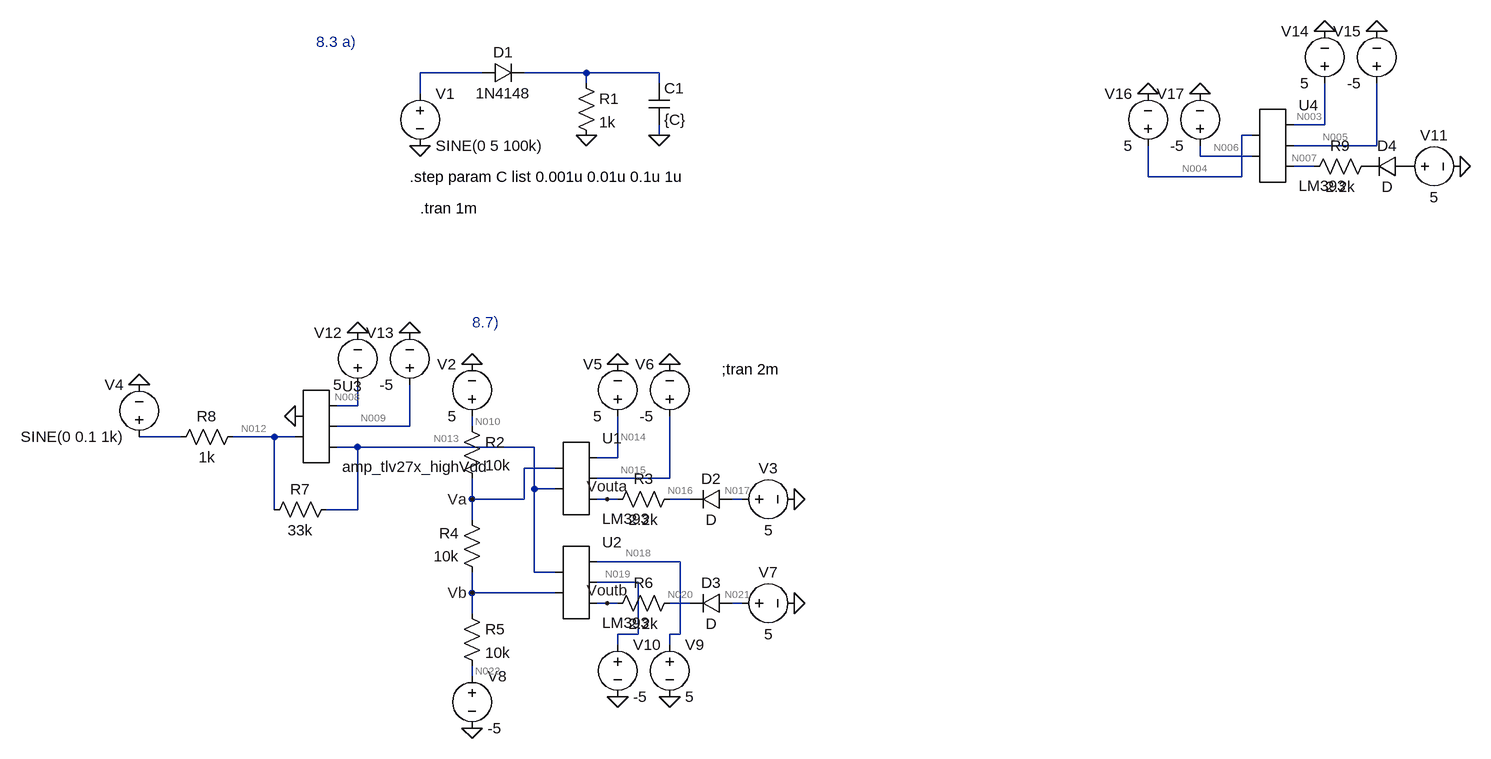
[diagram p0: schematic Lab8.asc]
Lab8.asc, the LTspice schematic file:
Version 4
SHEET 1 1524 1108
WIRE -16 80 -112 80
WIRE 144 80 48 80
WIRE 256 80 144 80
WIRE 144 96 144 80
WIRE 256 96 256 80
WIRE -112 112 -112 80
WIRE 1280 160 1280 96
WIRE 1280 160 1232 160
WIRE 256 176 256 160
WIRE 1168 176 1152 176
WIRE 1360 192 1360 96
WIRE 1360 192 1232 192
WIRE 1088 208 1088 192
WIRE 1168 208 1088 208
WIRE 1264 224 1232 224
WIRE 1008 240 1008 192
WIRE 1152 240 1152 176
WIRE 1152 240 1008 240
WIRE -208 592 -208 560
WIRE -208 592 -240 592
WIRE -128 624 -128 560
WIRE -128 624 -240 624
WIRE -32 624 -32 608
WIRE -480 640 -544 640
WIRE -336 640 -400 640
WIRE -304 640 -336 640
WIRE -208 656 -240 656
WIRE 64 656 -208 656
WIRE 192 672 192 608
WIRE 192 672 160 672
WIRE 96 688 48 688
WIRE 272 704 272 608
WIRE 272 704 160 704
WIRE 64 720 64 656
WIRE 96 720 64 720
WIRE -32 736 -32 704
WIRE 48 736 48 688
WIRE 48 736 -32 736
WIRE 176 736 160 736
WIRE 192 736 176 736
WIRE 304 736 272 736
WIRE 384 736 368 736
WIRE -336 752 -336 640
WIRE -208 752 -208 656
WIRE -208 752 -256 752
WIRE -32 768 -32 736
WIRE 288 832 160 832
WIRE 64 848 64 720
WIRE 96 848 64 848
WIRE 224 864 160 864
WIRE -32 880 -32 848
WIRE 96 880 -32 880
WIRE 176 896 160 896
WIRE 192 896 176 896
WIRE 304 896 272 896
WIRE 384 896 368 896
WIRE -32 912 -32 880
WIRE 224 944 224 864
WIRE 224 944 192 944
WIRE 288 944 288 832
WIRE 288 944 272 944
WIRE 192 960 192 944
WIRE 272 960 272 944
WIRE -32 1008 -32 992
FLAG -112 192 0
FLAG 144 176 0
FLAG 256 176 0
FLAG -32 528 0
FLAG 464 736 0
FLAG -32 736 Va
FLAG 192 528 0
FLAG 272 528 0
FLAG 176 736 Vouta
FLAG -32 880 Vb
FLAG 464 896 0
FLAG -32 1088 0
FLAG 272 1040 0
FLAG 192 1040 0
FLAG 176 896 Voutb
FLAG -208 480 0
FLAG -128 480 0
FLAG -304 608 0
FLAG -544 560 0
FLAG 1488 224 0
FLAG 1280 16 0
FLAG 1360 16 0
FLAG 1008 112 0
FLAG 1088 112 0
SYMBOL voltage -112 96 R0
WINDOW 123 0 0 Left 0
WINDOW 39 0 0 Left 0
SYMATTR InstName V1
SYMATTR Value SINE(0 5 100k)
SYMBOL res 128 80 R0
SYMATTR InstName R1
SYMATTR Value 1k
SYMBOL diode -16 96 R270
WINDOW 0 32 32 VTop 2
WINDOW 3 0 32 VBottom 2
SYMATTR InstName D1
SYMATTR Value 1N4148
SYMBOL cap 240 96 R0
SYMATTR InstName C1
SYMATTR Value {C}
SYMBOL voltage -32 624 R180
WINDOW 0 24 96 Left 2
WINDOW 3 24 16 Left 2
SYMATTR InstName V2
SYMATTR Value 5
SYMBOL voltage 368 736 R270
WINDOW 0 32 56 VTop 2
WINDOW 3 -32 56 VBottom 2
SYMATTR InstName V3
SYMATTR Value 5
SYMBOL res -48 608 R0
SYMATTR InstName R2
SYMATTR Value 10k
SYMBOL AutoGenerated\\LM393 128 704 R0
SYMATTR InstName U1
SYMBOL voltage 192 624 R180
WINDOW 0 24 96 Left 2
WINDOW 3 24 16 Left 2
SYMATTR InstName V5
SYMATTR Value 5
SYMBOL voltage 272 624 R180
WINDOW 0 24 96 Left 2
WINDOW 3 24 16 Left 2
SYMATTR InstName V6
SYMATTR Value -5
SYMBOL res 288 720 R90
WINDOW 0 0 56 VBottom 2
WINDOW 3 32 56 VTop 2
SYMATTR InstName R3
SYMATTR Value 2.2k
SYMBOL res -16 864 R180
WINDOW 0 36 76 Left 2
WINDOW 3 36 40 Left 2
SYMATTR InstName R4
SYMATTR Value 10k
SYMBOL diode 368 720 R90
WINDOW 0 0 32 VBottom 2
WINDOW 3 32 32 VTop 2
SYMATTR InstName D2
SYMBOL res -48 896 R0
SYMATTR InstName R5
SYMATTR Value 10k
SYMBOL voltage 368 896 R270
WINDOW 0 32 56 VTop 2
WINDOW 3 -32 56 VBottom 2
SYMATTR InstName V7
SYMATTR Value 5
SYMBOL AutoGenerated\\LM393 128 864 R0
SYMATTR InstName U2
SYMBOL res 288 880 R90
WINDOW 0 0 56 VBottom 2
WINDOW 3 32 56 VTop 2
SYMATTR InstName R6
SYMATTR Value 2.2k
SYMBOL diode 368 880 R90
WINDOW 0 0 32 VBottom 2
WINDOW 3 32 32 VTop 2
SYMATTR InstName D3
SYMBOL voltage -32 992 R0
SYMATTR InstName V8
SYMATTR Value -5
SYMBOL voltage 272 944 R0
SYMATTR InstName V9
SYMATTR Value 5
SYMBOL voltage 192 944 R0
SYMATTR InstName V10
SYMATTR Value -5
SYMBOL AutoGenerated\\amp_tlv27x_highVdd -272 624 R0
SYMATTR InstName U3
SYMBOL voltage -208 576 R180
WINDOW 0 24 96 Left 2
WINDOW 3 24 16 Left 2
SYMATTR InstName V12
SYMATTR Value 5
SYMBOL voltage -128 576 R180
WINDOW 0 24 96 Left 2
WINDOW 3 24 16 Left 2
SYMATTR InstName V13
SYMATTR Value -5
SYMBOL res -240 736 R90
WINDOW 0 0 56 VBottom 2
WINDOW 3 32 56 VTop 2
SYMATTR InstName R7
SYMATTR Value 33k
SYMBOL res -384 624 R90
WINDOW 0 0 56 VBottom 2
WINDOW 3 32 56 VTop 2
SYMATTR InstName R8
SYMATTR Value 1k
SYMBOL voltage -544 656 R180
WINDOW 0 24 96 Left 2
WINDOW 3 24 16 Left 2
WINDOW 123 0 0 Left 0
WINDOW 39 0 0 Left 0
SYMATTR InstName V4
SYMATTR Value SINE(0 0.1 1k)
SYMBOL diode 1408 208 R90
WINDOW 0 0 32 VBottom 2
WINDOW 3 32 32 VTop 2
SYMATTR InstName D4
SYMBOL voltage 1392 224 R270
WINDOW 0 32 56 VTop 2
WINDOW 3 -32 56 VBottom 2
SYMATTR InstName V11
SYMATTR Value 5
SYMBOL res 1360 208 R90
WINDOW 0 0 56 VBottom 2
WINDOW 3 32 56 VTop 2
SYMATTR InstName R9
SYMATTR Value 2.2k
SYMBOL AutoGenerated\\LM393 1200 192 R0
SYMATTR InstName U4
SYMBOL voltage 1280 112 R180
WINDOW 0 24 96 Left 2
WINDOW 3 24 16 Left 2
SYMATTR InstName V14
SYMATTR Value 5
SYMBOL voltage 1360 112 R180
WINDOW 0 24 96 Left 2
WINDOW 3 24 16 Left 2
SYMATTR InstName V15
SYMATTR Value -5
SYMBOL voltage 1008 208 R180
WINDOW 0 24 96 Left 2
WINDOW 3 24 16 Left 2
SYMATTR InstName V16
SYMATTR Value 5
SYMBOL voltage 1088 208 R180
WINDOW 0 24 96 Left 2
WINDOW 3 24 16 Left 2
SYMATTR InstName V17
SYMATTR Value -5
TEXT -272 32 Left 2 ;8.3 a)
TEXT -128 240 Left 2 !.step param C list 0.001u 0.01u 0.1u 1u
TEXT -32 464 Left 2 ;8.7)
TEXT 352 536 Left 2 !;tran 2m
TEXT -112 288 Left 2 !.tran 1m

The netlist it stands for:
* Lab8.asc
V1 N001 0 SINE(0 5 100k)
R1 N002 0 1k
D1 N001 N002 1N4148
C1 N002 0 {C}
V2 N010 0 5
V3 N017 0 5
R2 N010 Va 10k
* U1: LM393 (symbol AutoGenerated\LM393 not available, pins judged from their places): pin1=Va pin2=N013 pin3=N014 pin4=N015 pin5=Vouta
V5 N014 0 5
V6 N015 0 -5
R3 N016 Vouta 2.2k
R4 Vb Va 10k
D2 N017 N016 D
R5 Vb N022 10k
V7 N021 0 5
* U2: LM393 (symbol AutoGenerated\LM393 not available, pins judged from their places): pin1=N013 pin2=Vb pin3=N018 pin4=N019 pin5=Voutb
R6 N020 Voutb 2.2k
D3 N021 N020 D
V8 N022 0 -5
V9 N018 0 5
V10 N019 0 -5
* U3: amp_tlv27x_highVdd (symbol AutoGenerated\amp_tlv27x_highVdd not available, pins judged from their places): pin1=0 pin2=N012 pin3=N008 pin4=N009 pin5=N013
V12 N008 0 5
V13 N009 0 -5
R7 N013 N012 33k
R8 N012 N011 1k
V4 N011 0 SINE(0 0.1 1k)
D4 P001 P002 D
V11 P001 0 5
R9 P002 N007 2.2k
* U4: LM393 (symbol AutoGenerated\LM393 not available, pins judged from their places): pin1=N004 pin2=N006 pin3=N003 pin4=N005 pin5=N007
V14 N003 0 5
V15 N005 0 -5
V16 N004 0 5
V17 N006 0 -5
.model D D
.lib standard.dio
* 8.3 a)
.step param C list 0.001u 0.01u 0.1u 1u
* 8.7)
;tran 2m
.tran 1m
.backanno
.end

* Results of the author's LTspice run, read from the files saved beside the schematic
* Operating Point (first step), zero values left out:
*   c = 1 n
*   V(n010) = 5 V
*   V(n017) = 5 V
*   V(va) = 1.667 V
*   V(n014) = 5 V
*   V(n013) = -9.527 mV
*   V(n015) = -5 V
*   V(vouta) = 4.822 V
*   V(n016) = 4.822 V
*   V(vb) = -1.666 V
*   V(n022) = -5 V
*   V(n021) = 5 V
*   V(n018) = 5 V
*   V(n019) = -5 V
*   V(voutb) = 4.822 V
*   V(n020) = 4.822 V
*   V(n009) = -5 V
*   V(n008) = 5 V
*   V(n012) = -280.2 µV
*   V(p001) = 5 V
*   V(p002) = 4.822 V
*   V(n007) = 4.822 V
*   V(n003) = 5 V
*   V(n004) = 5 V
*   V(n006) = -5 V
*   V(n005) = -5 V
*   I(D4) = 9.853 pA
*   I(D3) = 9.853 pA
*   I(D2) = 9.853 pA
*   I(R9) = 9.807 pA
*   I(R8) = -280.2 nA
*   I(R7) = -280.2 nA
*   I(R6) = 9.807 pA
*   I(R5) = 333.4 µA
*   I(R4) = -333.3 µA
*   I(R3) = 9.807 pA
*   I(R2) = 333.3 µA
*   I(V17) = 49.98 nA
*   I(V16) = -20.07 pA
*   I(V15) = 315.9 µA
*   I(V14) = -316 µA
*   I(V11) = -9.807 pA
*   I(V4) = -280.2 nA
*   I(V13) = 67.78 µA
*   I(V12) = -67.78 µA
*   I(V10) = 315.9 µA
*   I(V9) = -316 µA
*   I(V8) = 333.4 µA
*   I(V7) = -9.807 pA
*   I(V6) = 315.9 µA
*   I(V5) = -316 µA
*   I(V3) = -9.807 pA
*   I(V2) = -333.3 µA